# EAGLE schematic anodeShield (EAGLE 6.5.0)
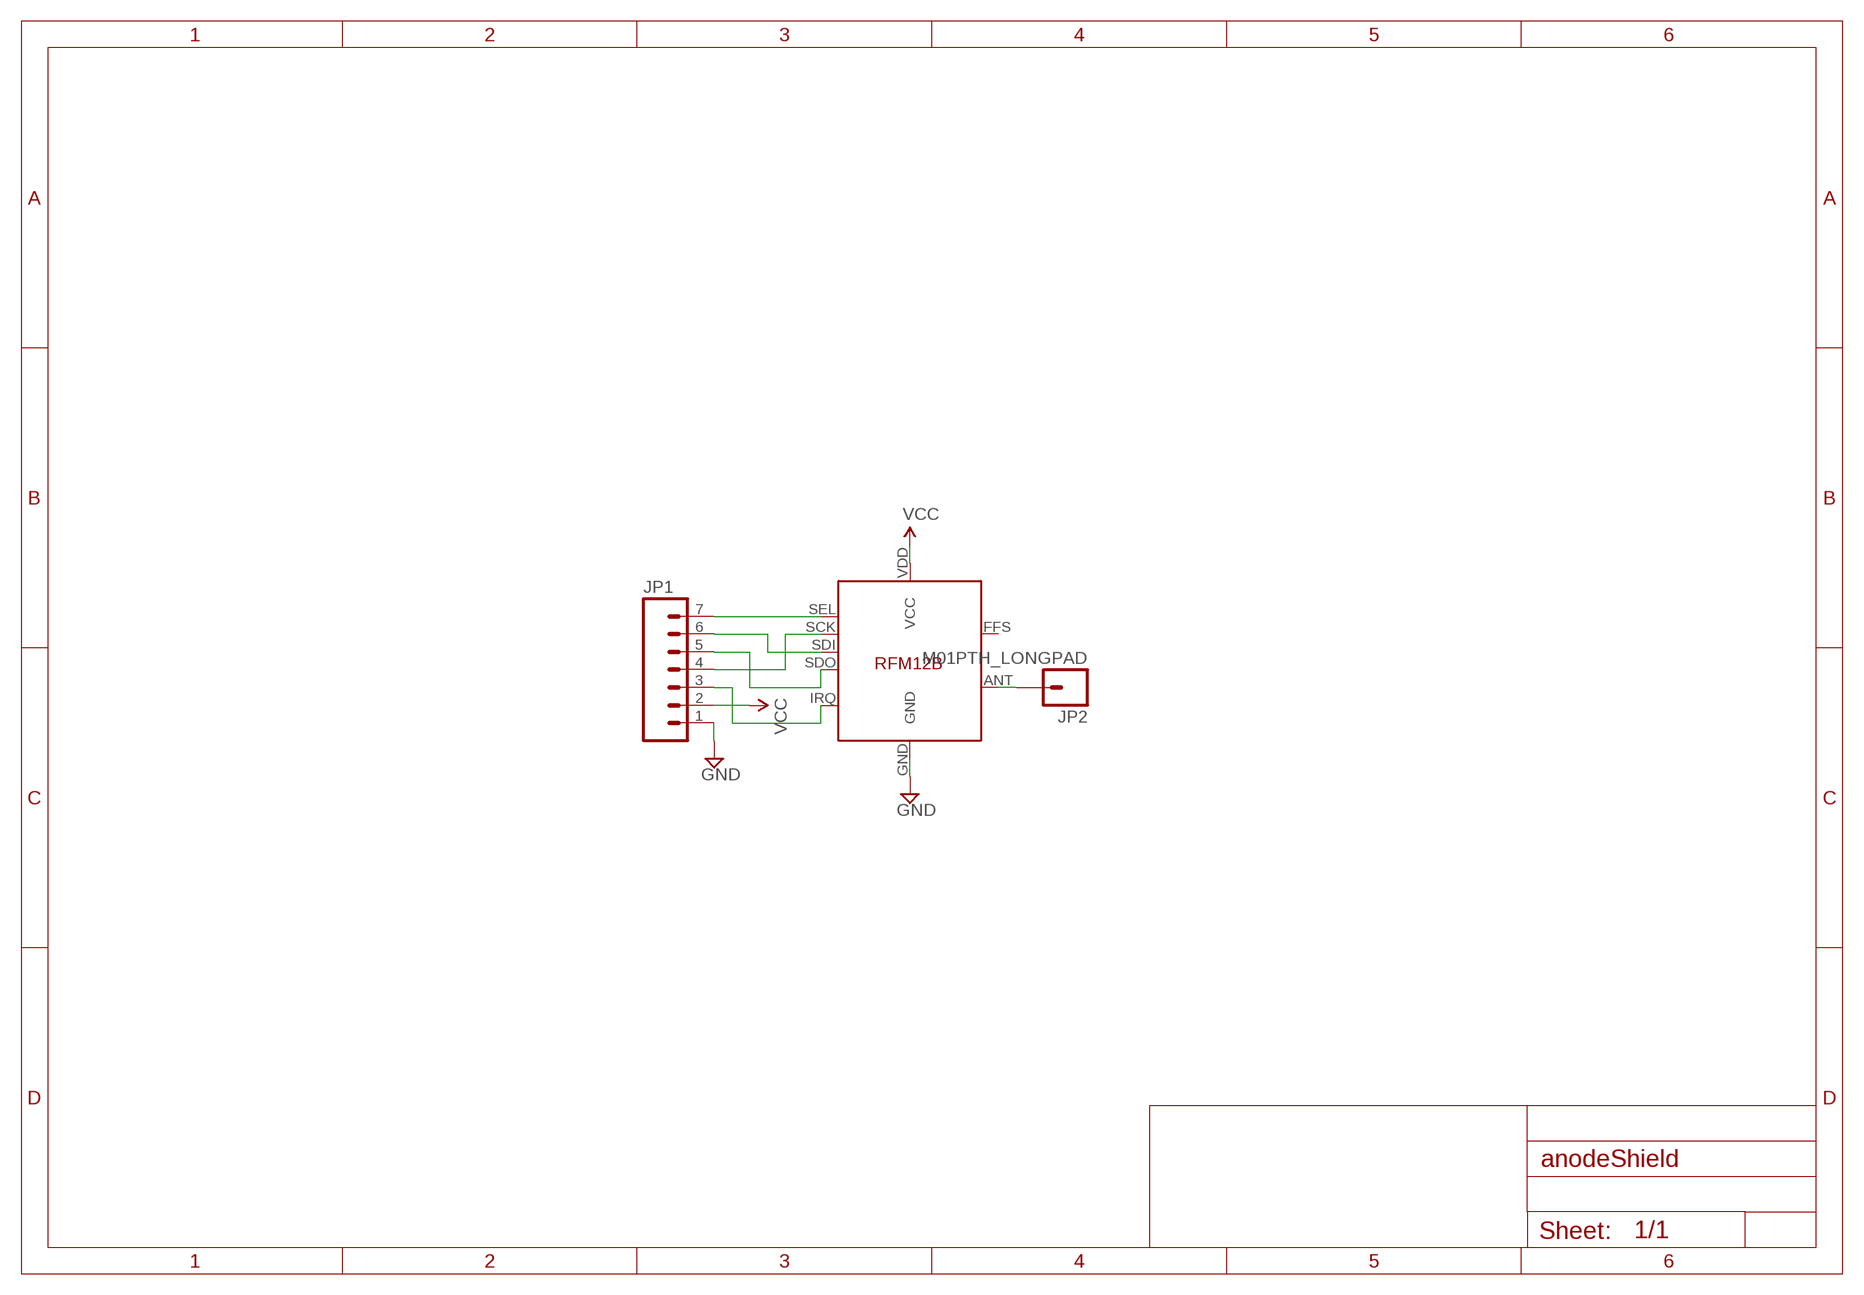
[diagram p0: schematic, sheet 1]

## Parts
JP1  M07LONGPADS  [1X07_LONGPADS]
JP2  M01PTH_LONGPAD  [1X01_LONGPAD]
U$1  RFM12B  [RFM12B]

## Nets
GND [power]: JP1.1 U$1.GND
N$1: JP1.7 U$1.SEL
N$2: JP1.4 U$1.SCK
N$3: JP1.6 U$1.SDI
N$4: JP1.5 U$1.SDO
N$5: JP1.3 U$1.IRQ
N$6: JP2.1 U$1.ANT
VCC [power]: JP1.2 U$1.VDD(VCC)
Unconnected: U$1.FFS

## Library data of the parts
JP1 = SparkFun-Connectors:M07: Header 7 Standard 7-pin 0.1" header. Use with straight break away headers (SKU : PRT-00116), right angle break away headers (PRT-00553), swiss pins (PRT-00743), machine pins (PRT-00117), and female headers (PRT-00115). NOTES ON THE VARIANTS LOCK and LOCK_LONGPADS... This footprint was designed to help hold the alignment of a through-hole component (i.e. 7-pin header) while soldering it into place. You may notice that each hole has been shifted either up or down by 0.005 of an inch from it's more standard position (which is usually a perfectly straight line). This slight alteration caused the pins (the squares in the middle) to touch the edges of the holes. Because they are alternating, it causes a "brace" to hold the header in place. 0.005 has proven to be the perfect amount of "off-center" position when using our standard breakaway headers. Although looks a little odd when you look at the bare footprint, once you have a header in there, the alteration is very hard to notice. Also, if you push a header all the way into place, it is covered up entirely on the bottom side. This idea of altering the position of holes to aid alignment will be further integrated into the Sparkfun Library for other footprints. It can help hold any component with 3 or more connection pins.
JP2 = SparkFun-Connectors:M01: Header 1 Standard 1-pin 0.1" header. Use with straight break away headers (SKU : PRT-00116), right angle break away headers (PRT-00553), swiss pins (PRT-00743), machine pins (PRT-00117), and female headers (PRT-00115).
U$1 = JeeLabs:RFM12B

## Net classes
1 power: width 0.406 mm